# Altium schematic sheet DIGITAL IO_RELAY_SHEET.SchDoc
size 420 x 297 mm; SheetNumber: 20; SheetTotal: 27
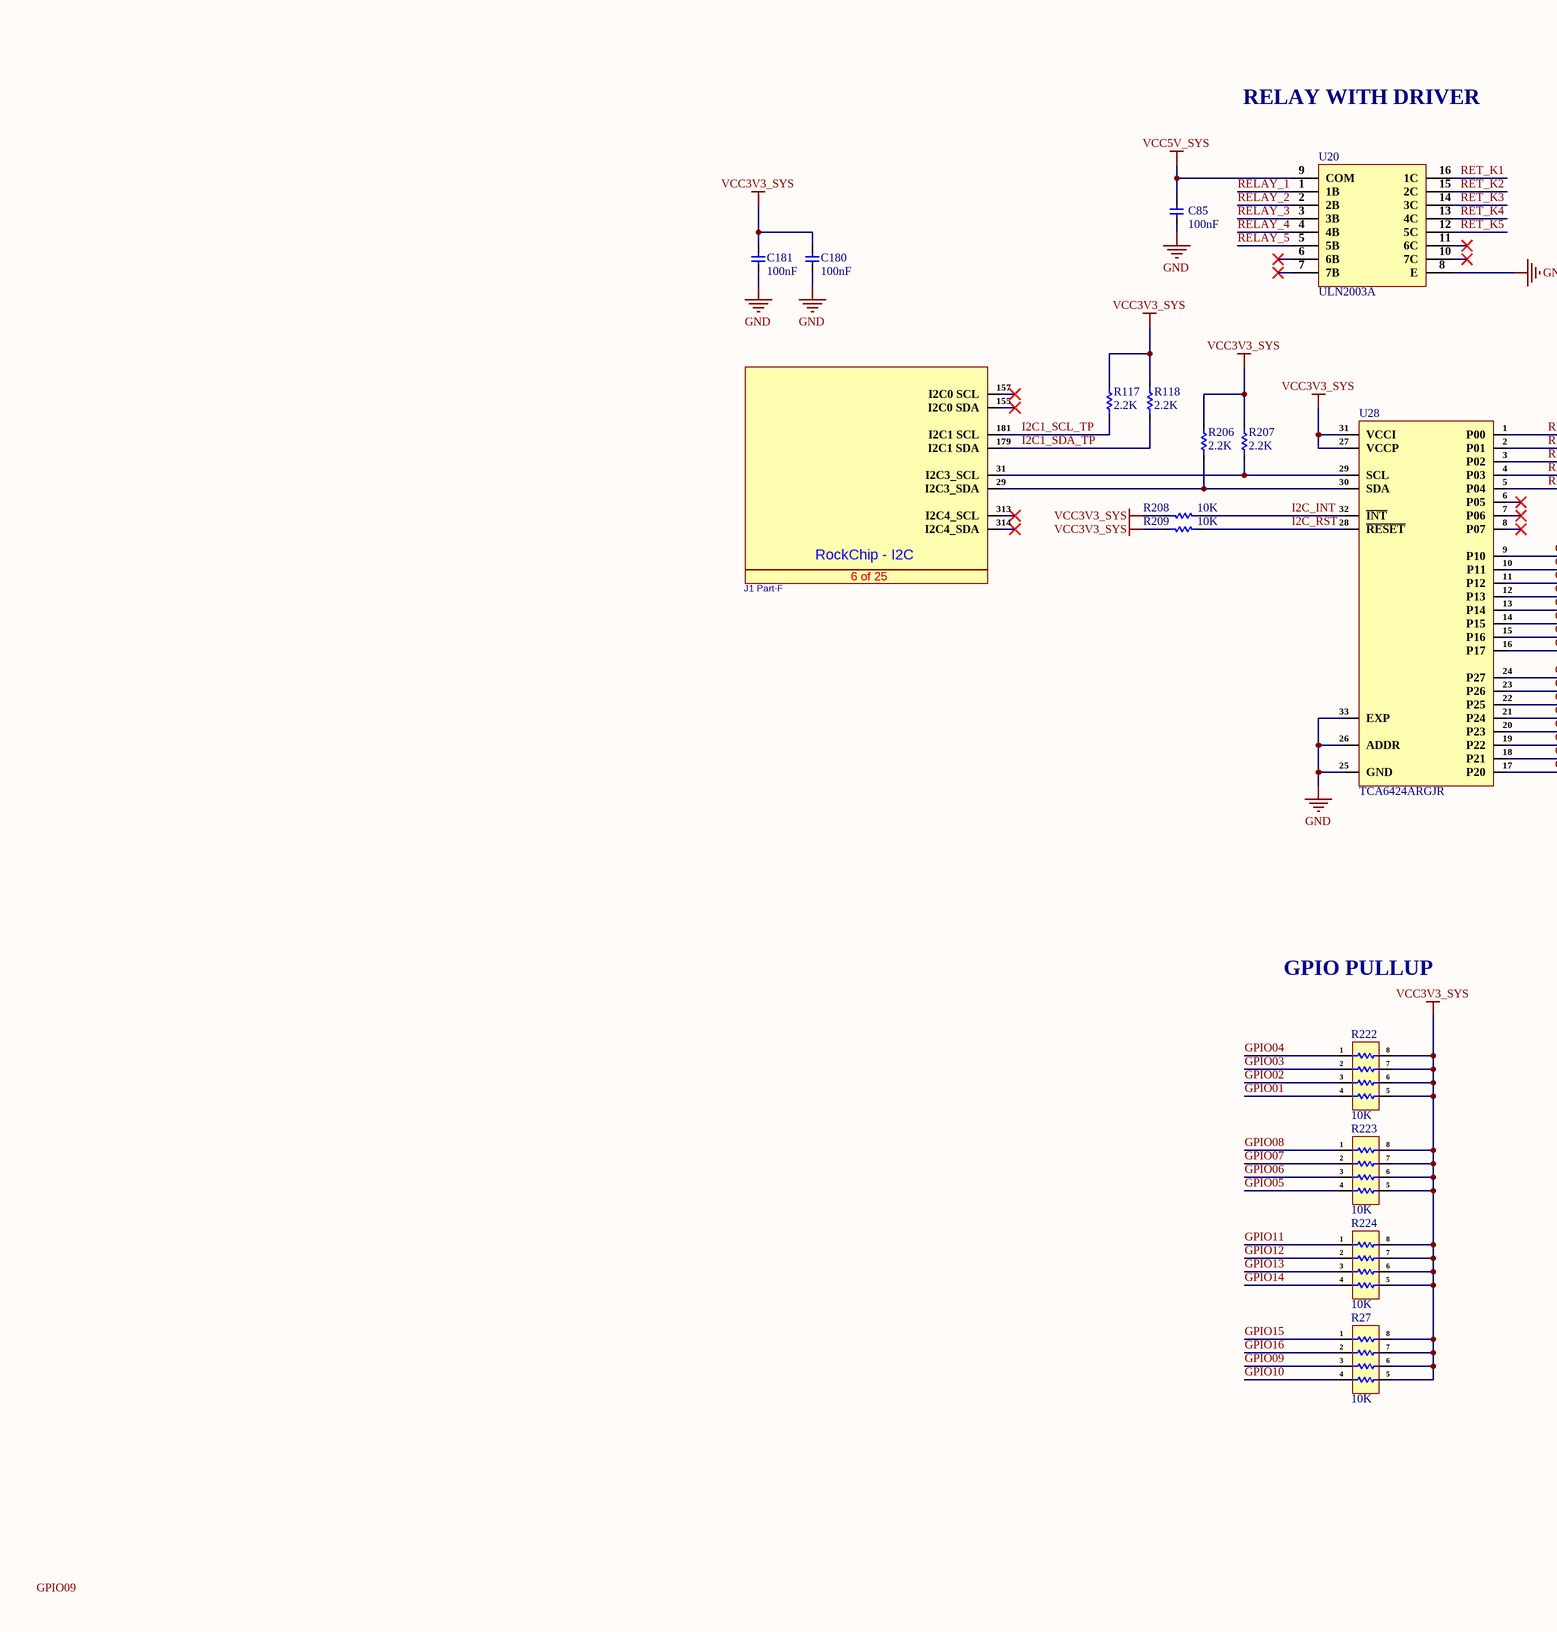
[diagram p0: DIGITAL IO_RELAY_SHEET.SchDoc, left]
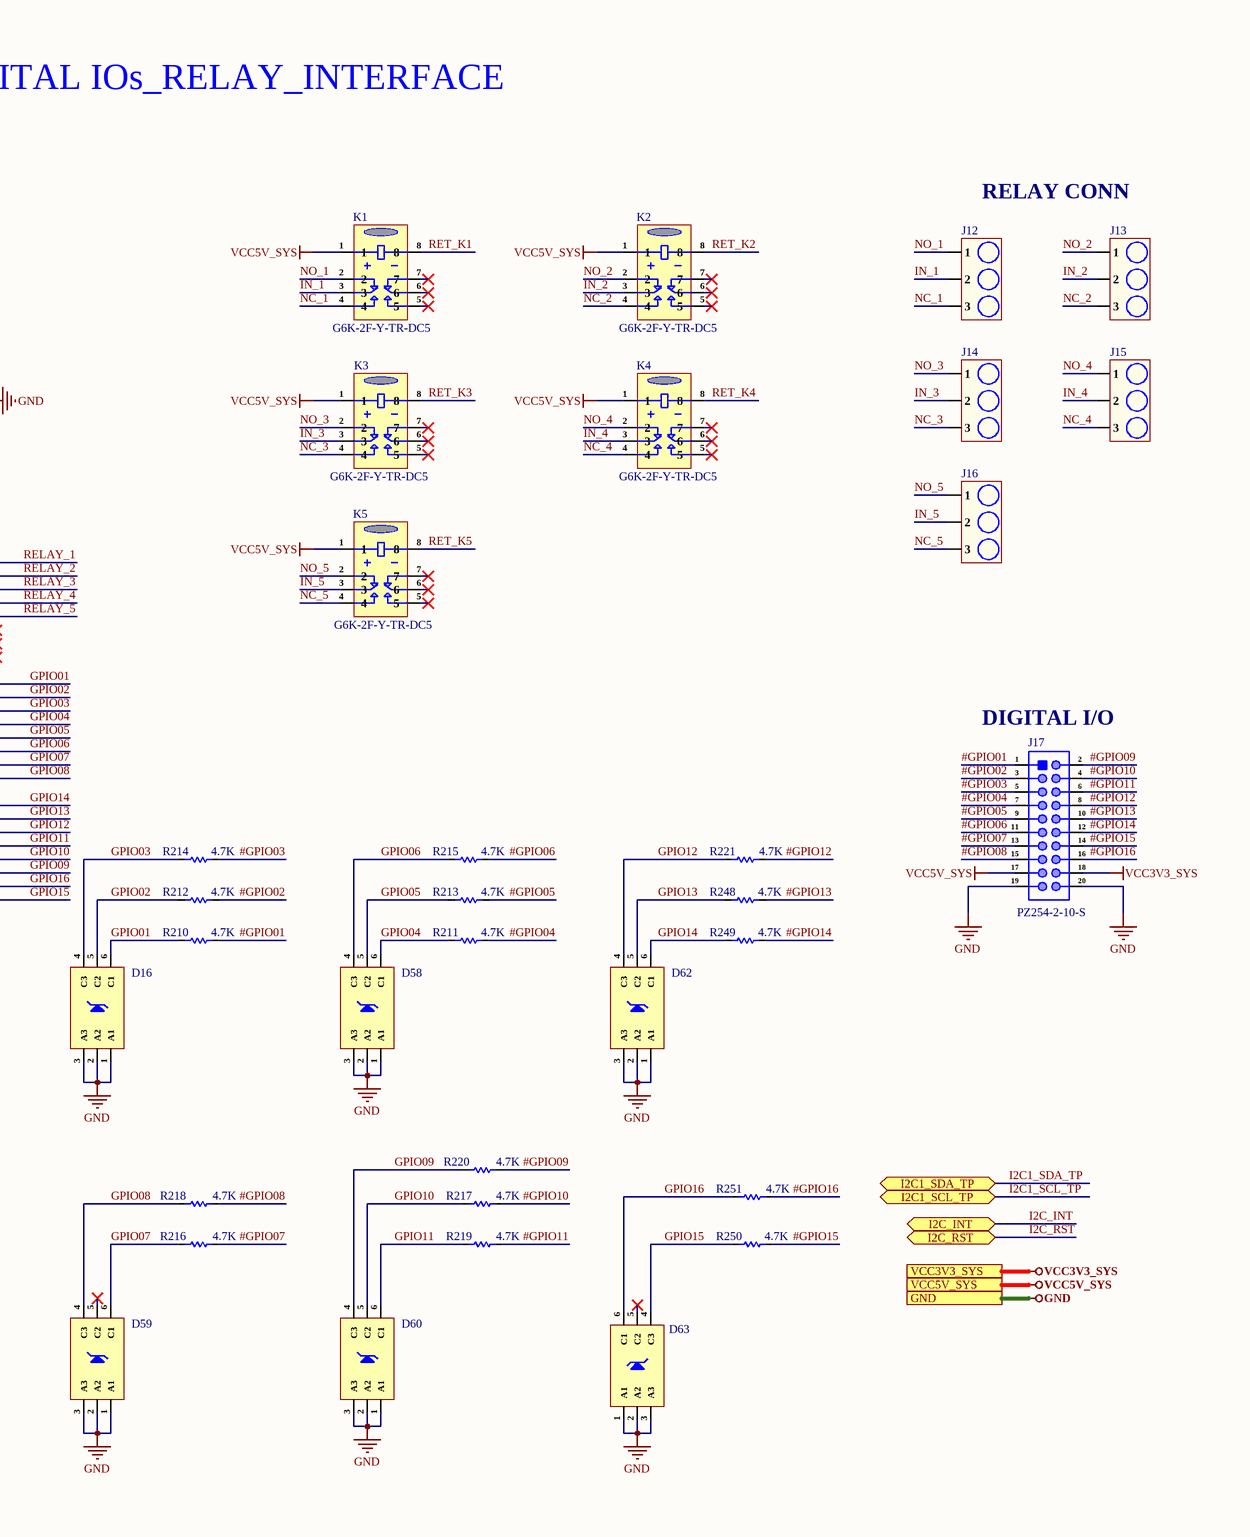
[diagram p1: DIGITAL IO_RELAY_SHEET.SchDoc, right]

## Parts
C85  100nF  [Cap-0402]
C180  100nF  [Cap-0402]
C181  100nF  [Cap-0402]
D16  BZX84C3V3TS-7-F  [SOT-363]  (value not drawn)
D58  BZX84C3V3TS-7-F  [SOT-363]  (value not drawn)
D59  BZX84C3V3TS-7-F  [SOT-363]  (value not drawn)
D60  BZX84C3V3TS-7-F  [SOT-363]  (value not drawn)
D62  BZX84C3V3TS-7-F  [SOT-363]  (value not drawn)
D63  BZX84C3V3TS-7-F  [SOT-363]  (value not drawn)
J1_Part-  AS0B826-S78B-7H  [AS0B826-S78B-7H]  (value not drawn)  (part F of 25)
J12  DB2ERC-3.5-3P-GN  [DB2ERC-3.5-3P-GN]  (value not drawn)
J13  DB2ERC-3.5-3P-GN  [DB2ERC-3.5-3P-GN]  (value not drawn)
J14  DB2ERC-3.5-3P-GN  [DB2ERC-3.5-3P-GN]  (value not drawn)
J15  DB2ERC-3.5-3P-GN  [DB2ERC-3.5-3P-GN]  (value not drawn)
J16  DB2ERC-3.5-3P-GN  [DB2ERC-3.5-3P-GN]  (value not drawn)
J17  PZ254-2-10-S  [PZ254-2-10-S]
K1  G6K-2F-Y-TR-DC5  [G6K-2F-Y-TR DC5]
K2  G6K-2F-Y-TR-DC5  [G6K-2F-Y-TR DC5]
K3  G6K-2F-Y-TR-DC5  [G6K-2F-Y-TR DC5]
K4  G6K-2F-Y-TR-DC5  [G6K-2F-Y-TR DC5]
K5  G6K-2F-Y-TR-DC5  [G6K-2F-Y-TR DC5]
R27  10K  [YC164-FR-0710KL]
R117  2.2K  [Res-0402]
R118  2.2K  [Res-0402]
R206  2.2K  [Res-0402]
R207  2.2K  [Res-0402]
R208  10K  [Res-0402]
R209  10K  [Res-0402]
R210  4.7K  [Res-0402]
R211  4.7K  [Res-0402]
R212  4.7K  [Res-0402]
R213  4.7K  [Res-0402]
R214  4.7K  [Res-0402]
R215  4.7K  [Res-0402]
R216  4.7K  [Res-0402]
R217  4.7K  [Res-0402]
R218  4.7K  [Res-0402]
R219  4.7K  [Res-0402]
R220  4.7K  [Res-0402]
R221  4.7K  [Res-0402]
R222  10K  [YC164-FR-0710KL]
R223  10K  [YC164-FR-0710KL]
R224  10K  [YC164-FR-0710KL]
R248  4.7K  [Res-0402]
R249  4.7K  [Res-0402]
R250  4.7K  [Res-0402]
R251  4.7K  [Res-0402]
U20  ULN2003A  [SOP-16_150mil]
U28  TCA6424ARGJR  [32-UQFN (5x5)]

## Ports
GND (see TOP SHEET[4B], AUDIO_INTERFACE[1D], BUCK REGULATOR[3D], DEBUG_UART_INTERFACE[3D], DUAL_SIM_INTERFACE[3D], ETHERNET_PHY0[4D], ETHERNET_PHY1[4D], GSM_INTERFACE[2D], HDMI_INTERFACE[3D], INPUT_PROTECTION[3D], LINEAR_VOLTAGE_REG[3D], MICRO_SD_INTERFACE[3D], MIPI-DSI DISPLAY[3D], POWER SECTION[3D], PUSH BUTTONs_INTERFACE[3C], RGB_LEDs_INTERFACE[3D], ROCKCHIP_PWR_SUPPLY[1D], ROCKCHIP_SYSTEM_CONTROL[3C], RS232_RS485_INTERFACE[3C], SENSOR_SHEET[3D], USB2.0_INTERFACE[3D], USB3.0_INTERFACE[3D], USB-C_INTERFACE[2D], WIEGAND_INTERFACE[3D], WIFI_BLUETOOTH_SHEET[4C]), I2C1_SCL_TP (bidir, see TOP SHEET[5B], MIPI-DSI DISPLAY[3D]), I2C1_SDA_TP (bidir, see TOP SHEET[5B], MIPI-DSI DISPLAY[3D]), I2C_INT (bidir, see TOP SHEET[5B], ROCKCHIP_GPIO_NC PINS[1D]), I2C_RST (bidir, see TOP SHEET[5B], ROCKCHIP_GPIO_NC PINS[1D]), VCC3V3_SYS (see TOP SHEET[4B], AUDIO_INTERFACE[1D], BUCK REGULATOR[3D], DEBUG_UART_INTERFACE[3D], ETHERNET_PHY0[4D], ETHERNET_PHY1[4D], GSM_INTERFACE[2D], HDMI_INTERFACE[3D], LINEAR_VOLTAGE_REG[3D], MIPI-DSI DISPLAY[3D], POWER SECTION[3D], PUSH BUTTONs_INTERFACE[3C], ROCKCHIP_PWR_SUPPLY[1D], ROCKCHIP_SYSTEM_CONTROL[3C], RS232_RS485_INTERFACE[3C], SENSOR_SHEET[3D], USB-C_INTERFACE[2D], WIEGAND_INTERFACE[3D], WIFI_BLUETOOTH_SHEET[4C]), VCC5V_SYS (see TOP SHEET[4B], BUCK REGULATOR[3D], HDMI_INTERFACE[3D], LINEAR_VOLTAGE_REG[3D], MIPI-DSI DISPLAY[3D], POWER SECTION[3D], RGB_LEDs_INTERFACE[3D], ROCKCHIP_PWR_SUPPLY[1D], USB2.0_INTERFACE[3D], USB3.0_INTERFACE[3D], USB-C_INTERFACE[2D], WIEGAND_INTERFACE[3D])

## Nets
GND: C85.2 C180.2 C181.2 D16.1(A1) D16.2(A2) D16.3(A3) D58.1(A1) D58.2(A2) D58.3(A3) D59.1(A1) D59.2(A2) D59.3(A3) D60.1(A1) D60.2(A2) D60.3(A3) D62.1(A1) D62.2(A2) D62.3(A3) D63.1(A1) D63.2(A2) D63.3(A3) J17.19 J17.20 U20.8(E) U28.25(GND) U28.26(ADDR) U28.33(EXP) ; port GND
VCC3V3_SYS: C180.1 C181.1 J17.18 R27.5 R27.6 R27.7 R27.8 R117.2 R118.2 R206.2 R207.2 R208.2 R209.2 R222.5 R222.6 R222.7 R222.8 R223.5 R223.6 R223.7 R223.8 R224.5 R224.6 R224.7 R224.8 U28.27(VCCP) U28.31(VCCI) ; port VCC3V3_SYS
VCC5V_SYS: C85.1 J17.17 K1.1 K2.1 K3.1 K4.1 K5.1 U20.9(COM) ; port VCC5V_SYS
#GPIO01: J17.1 R210.2
#GPIO02: J17.3 R212.2
#GPIO03: J17.5 R214.2
#GPIO04: J17.7 R211.2
#GPIO05: J17.9 R213.2
#GPIO06: J17.11 R215.2
#GPIO07: J17.13 R216.2
#GPIO08: J17.15 R218.2
#GPIO09: J17.2 R220.2
#GPIO10: J17.4 R217.2
#GPIO11: J17.6 R219.2
#GPIO12: J17.8 R221.2
#GPIO13: J17.10 R248.2
#GPIO14: J17.12 R249.2
#GPIO15: J17.14 R250.2
#GPIO16: J17.16 R251.2
GPIO01: D16.6(C1) R210.1 R222.4 U28.9(P10)
GPIO02: D16.5(C2) R212.1 R222.3 U28.10(P11)
GPIO03: D16.4(C3) R214.1 R222.2 U28.11(P12)
GPIO04: D58.6(C1) R211.1 R222.1 U28.12(P13)
GPIO05: D58.5(C2) R213.1 R223.4 U28.13(P14)
GPIO06: D58.4(C3) R215.1 R223.3 U28.14(P15)
GPIO07: D59.6(C1) R216.1 R223.2 U28.15(P16)
GPIO08: D59.4(C3) R218.1 R223.1 U28.16(P17)
GPIO09: D60.4(C3) R27.3 R220.1 U28.19(P22)
GPIO10: D60.5(C2) R27.4 R217.1 U28.20(P23)
GPIO11: D60.6(C1) R219.1 R224.1 U28.21(P24)
GPIO12: D62.4(C3) R221.1 R224.2 U28.22(P25)
GPIO13: D62.5(C2) R224.3 R248.1 U28.23(P26)
GPIO14: D62.6(C1) R224.4 R249.1 U28.24(P27)
GPIO15: D63.4(C3) R27.1 R250.1 U28.17(P20)
GPIO16: D63.6(C1) R27.2 R251.1 U28.18(P21)
I2C1_SCL_TP: J1_Part-.181(I2C1_SCL) R117.1 ; port I2C1_SCL_TP
I2C1_SDA_TP: J1_Part-.179(I2C1_SDA) R118.1 ; port I2C1_SDA_TP
I2C_INT: R208.1 U28.32(~{INT}) ; port I2C_INT
I2C_RST: R209.1 U28.28(~{RESET}) ; port I2C_RST
IN_1: J12.2 K1.3
IN_2: J13.2 K2.3
IN_3: J14.2 K3.3
IN_4: J15.2 K4.3
IN_5: J16.2 K5.3
NC_1: J12.3 K1.4
NC_2: J13.3 K2.4
NC_3: J14.3 K3.4
NC_4: J15.3 K4.4
NC_5: J16.3 K5.4
NO_1: J12.1 K1.2
NO_2: J13.1 K2.2
NO_3: J14.1 K3.2
NO_4: J15.1 K4.2
NO_5: J16.1 K5.2
RELAY_1: U20.1(1B) U28.1(P00)
RELAY_2: U20.2(2B) U28.2(P01)
RELAY_3: U20.3(3B) U28.3(P02)
RELAY_4: U20.4(4B) U28.4(P03)
RELAY_5: U20.5(5B) U28.5(P04)
RET_K1: K1.8 U20.16(1C)
RET_K2: K2.8 U20.15(2C)
RET_K3: K3.8 U20.14(3C)
RET_K4: K4.8 U20.13(4C)
RET_K5: K5.8 U20.12(5C)
NetJ1_Part-_29: J1_Part-.29(I2C3_SDA) R206.1 U28.30(SDA)
NetJ1_Part-_31: J1_Part-.31(I2C3_SCL) R207.1 U28.29(SCL)

Not connected (* = marked no-connect by the designer): D59 5(C2)*; D63 5(C2)*; J1_Part- 155(I2C0_SDA)* 157(I2C0_SCL)* 313(I2C4_SCL)* 314(I2C4_SDA)*; K1 5* 6* 7*; K2 5* 6* 7*; K3 5* 6* 7*; K4 5* 6* 7*; K5 5* 6* 7*; U20 6(6B)* 7(7B)* 10(7C)* 11(6C)*; U28 6(P05)* 7(P06)* 8(P07)*

## Notes on the sheet
- DIGITAL IOs_RELAY_INTERFACE
- RELAY WITH DRIVER
- RELAY CONN
- (near J17) DIGITAL I/O
- GPIO PULLUP
- Labels drawn without touching a wire or pin: GPIO09
- File:
- Title:
- Date:
- Page
- Num:
- Total:
- Drawn By: Huzaifa Ali
- (in symbol AS0B826-S78B-7H, part F) RockChip - I2C; 6 of 25

## Library data of the parts
C85 C180 C181 = CC0402KRX5R7BB104: CAP CER 0.1UF 16V X5R 0402; Manufacturer: Yageo; Tolerance: 10%; Manufacturer Part Number: CC0402KRX5R7BB104; RoHS: Yes; Category: Ceramic Capacitors; Supplier 1: Mouser; Stock 1: 936792; Pricing 1: 1=0.10000, 10=0.02300, 50=0.02300, 100=0.01100, 1000=0.00600, 10000=0.00400 (USD); Mount: Surface Mount; Case/Package: 0402; Number of Pins: 2; Case Code (Metric): 1005; Case Code (Imperial): 0402; Min Operating Temperature: -55°C; Max Operating Temperature: 85°C; Capacitance: 100nF; Dielectric: X5R; Packaging: Tape and Reel; Voltage Rating: 16V; Package Quantity: 1; Voltage Rating (DC): 16V; Termination: SMD/SMT; Resistor Type: Ceramic; Series: CC; Construction: Flat; Length: 1mm; Width: 0.02inch; Height: 0.5mm; Thickness: 0.022inch; Depth: 0.5mm; Radiation Hardening: No; REACH SVHC: Unknown; Lead Free: Lead Free; Halogen Free: Halogen Free; RoHS Compliant: Yes; ComponentLink1URL: https://datasheet.ciiva.com/155/mlccorderingcode-155879.pdf?src-supplier=Digi-Key; ComponentLink1Description: https://datasheet.ciiva.com/155/mlccorderingcode-155879.pdf?src-supplier=Digi-Key; ComponentLink2URL: https://datasheet.ciiva.com/155/mlccorderingcode-155878.pdf?src-supplier=Digi-Key; ComponentLink2Description: https://datasheet.ciiva.com/155/mlccorderingcode-155878.pdf?src-supplier=Digi-Key; ComponentLink3URL: https://datasheet.ciiva.com/155/mlccorderingcode-155880.pdf?src-supplier=Digi-Key; ComponentLink3Description: https://datasheet.ciiva.com/155/mlccorderingcode-155880.pdf?src-supplier=Digi-Key; ComponentLink4URL: https://datasheet.ciiva.com/11464/upy-gphc-x5r-4v-to-50v-12-11464869.pdf?src-supplier=Avnet; ComponentLink4Description: https://datasheet.ciiva.com/11464/upy-gphc-x5r-4v-to-50v-12-11464869.pdf?src-supplier=Avnet; Supplier Part Number 1: 603-CC402KRX5R7BB104; LCSC Part Number: C106204
D16 D58-D60 D62 D63 = BZX84C3V3TS-7-F: DIODE ZENER ARRAY 3.3V SOT363; Manufacturer: Diodes Incorporated; Manufacturer Part Number: BZX84C3V3TS-7-F; Package: SOT-363-6; LCSC Part Number: C5124989; Item Type: Diode; ComponentLink1Description: LCSC; ComponentLink1URL: https://www.lcsc.com/product-detail/Zener-Diodes_Diodes-Incorporated-BZX84C3V3TS-7-F_C5124989.html
J1_Part- = AS0B826-S78B-7H: SMD,P=0.5mm,Surface Mount，Right Angle; Manufacturer: FOXCONN; Item Type: Card Edge Connectors; Supplier: LCSC; Manufacturer Part Number: AS0B826-S78B-7H; RoHS: No; Stock: 4979; Pricing: 1=9.21, 10=8.287, 25=7.8064, 50=7.6064, 100=7.4062 (USD); LCSC Part Number: C426232
J12-J16 = DB2ERC-3.5-3P-GN: 250V 10A 3 Bend -40℃~+105℃ 1 3.5mm 1x3P Green Board Edge/Receptacle-Close Push-Pull,P=3.5mm Pluggable System Terminal Block ROHS; Manufacturer: DORABO; Manufacturer Part Number: DB2ERC-3.5-3P-GN; Package: Push-Pull,P=5.08mm; LCSC Part Number: C430551; Item Type: Terminal Block; ComponentLink1Description: LCSC; ComponentLink1URL: https://www.lcsc.com/product-detail/Pluggable-System-span-style-background-color-ff0-Terminal-span-span-style-background-color-ff0-Block-span_DORABO-DB2ERC-3-5-3P-GN_C430551.html
J17 = PZ254-2-10-S: 250V 3A Brick nogging Square Pins 2.5mm 260℃@5S 6mm 20P -40℃~+105℃ 2.54mm 双排 Black 2.54mm 2x10P SMD,P=2.54mm Pin Headers ROHS; Manufacturer: HCTL; Item Type: Male Header; Manufacturer Part Number: PZ254-2-10-S; LCSC Part Number: C3294468
K1-K5 = G6K-2F-Y-TR-DC5: RELAY TELECOM DPDT 1A 5V; Manufacturer: Omron; Supplier: Digikey; Supplier Part Number: Z128CT-ND; Manufacturer Part Number: G6K-2F-Y-TR-DC5; RoHS: Yes; Category: Signal Relays; Stock: 17486; Pricing: 1=4.49, 10=4.211, 25=3.7428, 50=3.5558, 100=3.3686, 250=2.99428 (USD); ComponentLink1URL: https://datasheet.ciiva.com/2416/en-g6k-2416490.pdf?src-supplier=Digikey; ComponentLink1Description: https://datasheet.ciiva.com/2416/en-g6k-2416490.pdf?src-supplier=Digikey; ComponentLink2URL: https://datasheet.ciiva.com/30094/81en-g6k-30094551.pdf?src-supplier=Onlinecomponents.com; ComponentLink2Description: https://datasheet.ciiva.com/30094/81en-g6k-30094551.pdf?src-supplier=Onlinecomponents.com; LCSC Part Number: C47190; Item Type: Relay
R27 R222-R224 = YC164-FR-0710KL: RES ARRAY 4 RES 10K OHM 1206; Manufacturer: Yageo; Item Type: Resistor Array; Tolerance: 1%; Voltage Rating: 50V; Number of Elements: 4; Value: 10kR; Circuit Type: Isolated; Power Per Element: 62.5mW; Temperature Coefficient: 200ppm/°C; Manufacturer Part Number: YC164-FR-0710KL; RoHS: Yes; Category: Resistor Arrays; ComponentLink1URL: http://www.farnell.com/datasheets/2167431.pdf?src-supplier=Farnell; ComponentLink1Description: http://www.farnell.com/datasheets/2167431.pdf?src-supplier=Farnell; ComponentLink2URL: https://media.digikey.com/pdf/Data%20Sheets/Yageo%20PDFs/YC102-358,TC122-164_Series_DS.pdf?src-supplier=Digi-Key; ComponentLink2Description: https://media.digikey.com/pdf/Data%20Sheets/Yageo%20PDFs/YC102-358,TC122-164_Series_DS.pdf?src-supplier=Digi-Key; ComponentLink3URL: http://www.farnell.com/datasheets/2167431.pdf?src-supplier=Element14; ComponentLink3Description: http://www.farnell.com/datasheets/2167431.pdf?src-supplier=Element14; ComponentLink4URL: http://www.farnell.com/datasheets/443424.pdf?src-supplier=Element14; ComponentLink4Description: http://www.farnell.com/datasheets/443424.pdf?src-supplier=Element14; ComponentLink5URL: http://www.farnell.com/datasheets/2167431.pdf?src-supplier=Newark; ComponentLink5Description: http://www.farnell.com/datasheets/2167431.pdf?src-supplier=Newark; LCSC Part Number: C110924; Supplier 1: Future Electronics; Stock 1: 25000; Pricing 1: 5000=0.0101, 20000=0.0095, 50000=0.0092, 125000=0.0089, 200000=0.0085 (USD); Mounting Technology: Surface Mount; Pins: 8; Case Code (Metric): 3216; Case Code (Imperial): 1206; Min Operating Temperature: -55°C; Max Operating Temperature: 155°C; Packaging: Tape and Reel; Number of Resistors: 4; Number of Circuits: 4; Series: YC164; Resistance Tolerance: 1%; Length: 0.126inch; Width: 0.063inch; Height: 0.028inch; Lead Free: Lead Free; RoHS Compliant: Yes; Reach SVHC Compliant: Unknown; Supplier Part Number 1: 5054288
R117 R118 R206 R207 = RC0402FR-072K2L: RES SMD 2.2K OHM 1% 1/16W 0402; Manufacturer: Yageo; Power Rating: 63mW; Resistance: 2.2kR; Voltage Rating: 50V; Temperature Coefficient: 100ppm/°C; Supplier 1: Digi-Key; Manufacturer Part Number: RC0402FR-072K2L; Stock 1: 966157; Pricing 1: 1=0.1, 10=0.016, 100=0.0066, 1000=0.00299, 2500=0.00259, 5000=0.00214 (USD); Case/Package: 0402; Case Code (Imperial): 0402; Case Code (Metric): 1005; Size Code: 0402; Min Operating Temperature: -55°C; Max Operating Temperature: 155°C; Tolerance: 1%; Packaging: Tape and Reel; Resistor Type: Thick Film; Termination: SMD/SMT; Features: Moisture Resistant; Series: RC; Max Power Dissipation: 63mW; Number of Terminations: 2; Resistance Tolerance: 1%; Construction: Rectangular; Length: 1mm; Width: 0.5mm; Height: 0.35mm; Depth: 0.5mm; RoHS Compliant: Yes; Military Standard: Not; Lead Free: Lead Free; ComponentLink1URL: http://www.farnell.com/datasheets/2167052.pdf?src-supplier=Element14; ComponentLink1Description: http://www.farnell.com/datasheets/2167052.pdf?src-supplier=Element14; ComponentLink2URL: http://www.yageo.com/documents/recent/PYu-RC_Group_51_RoHS_L_9.pdf?src-supplier=Mouser; ComponentLink2Description: http://www.yageo.com/documents/recent/PYu-RC_Group_51_RoHS_L_9.pdf?src-supplier=Mouser; ComponentLink3URL: http://documents.rs-components.com/techlib://itc_doclist_GB.htm?stockno=6186532&src-supplier=RSComponents; ComponentLink3Description: http://documents.rs-components.com/techlib://itc_doclist_GB.htm?stockno=6186532&src-supplier=RSComponents; ComponentLink4URL: http://www.yageo.com/documents/recent/PYu-RC0402_51_RoHS_L_6_r.pdf?src-supplier=Future+Electronics; ComponentLink4Description: http://www.yageo.com/documents/recent/PYu-RC0402_51_RoHS_L_6_r.pdf?src-supplier=Future+Electronics; Supplier Part Number 1: 311-2.20KLRCT-ND; LCSC Part Number: C114762; Weight: 2.3E-05oz; Technology: THICK FILM; REACH SVHC: Unknown
R208 R209 = RC0402FR-0710KL: RES 10K OHM 1% 1/16W 0402; Manufacturer: Yageo; Resistance: 10kR; Voltage Rating (DC): 50V; Temperature Coefficient: 100ppm/°C; Power Rating: 62.5mW; Max Power Dissipation: 63mW; Item Type: Resistor; Supplier 1: Mouser; Manufacturer Part Number: RC0402FR-0710KL; RoHS: Yes; Category: Chip SMD Resistors; Stock 1: 18648329; Pricing 1: 1=0.10000, 10=0.01400, 50=0.01400, 100=0.00500, 1000=0.00300, 10000=0.00200 (USD); Case/Package: 0402; Number of Pins: 2; Case Code (Imperial): 0402; Case Code (Metric): 1005; Min Operating Temperature: -55°C; Max Operating Temperature: 155°C; Resistor Type: Thick Film; Tolerance: 1%; Packaging: Tape and Reel; Voltage Rating: 50V; Termination: SMD/SMT; Working Voltage: 50V; Number of Terminations: 2; Features: Moisture Resistant; Series: RC; Resistance Tolerance: 1%; Construction: Rectangular; Length: 1mm; Width: 0.5mm; Height: 0.32mm; Depth: 0.5mm; Lead Pitch: 0.2mm; REACH SVHC: No SVHC; Lead Free: Lead Free; RoHS Compliant: Yes; Military Standard: Not; ComponentLink1URL: https://datasheet.ciiva.com/7660/38568-7660787.pdf?src-supplier=Element14; ComponentLink1Description: https://datasheet.ciiva.com/7660/38568-7660787.pdf?src-supplier=Element14; ComponentLink2URL: https://datasheet.ciiva.com/7849/1686128-7849814.pdf?src-supplier=Element14; ComponentLink2Description: https://datasheet.ciiva.com/7849/1686128-7849814.pdf?src-supplier=Element14; ComponentLink3URL: https://datasheet.ciiva.com/7983/1018594-7983486.pdf?src-supplier=Element14; ComponentLink3Description: https://datasheet.ciiva.com/7983/1018594-7983486.pdf?src-supplier=Element14; ComponentLink4URL: https://datasheet.ciiva.com/22747/1018594-22747512.pdf?src-supplier=Element14; ComponentLink4Description: https://datasheet.ciiva.com/22747/1018594-22747512.pdf?src-supplier=Element14; ComponentLink5URL: https://datasheet.ciiva.com/12667/pyu-rc0402-51-rohs-l-6-r-12667067.pdf?src-supplier=Mouser; ComponentLink5Description: https://datasheet.ciiva.com/12667/pyu-rc0402-51-rohs-l-6-r-12667067.pdf?src-supplier=Mouser; ComponentLink6URL: https://datasheet.ciiva.com/7849/1784430-7849813.pdf?src-supplier=Element14; ComponentLink6Description: https://datasheet.ciiva.com/7849/1784430-7849813.pdf?src-supplier=Element14; ComponentLink7URL: https://datasheet.ciiva.com/7849/1784430-7849815.pdf?src-supplier=Element14; ComponentLink7Description: https://datasheet.ciiva.com/7849/1784430-7849815.pdf?src-supplier=Element14; Supplier Part Number 1: 603-RC0402FR-0710KL; LCSC Part Number: C60490
R210-R221 R248-R251 = RC0402FR-074K7L: RES 4.7K OHM 1% 1/16W 0402; Manufacturer: Yageo; Voltage Rating (DC): 50V; Power Rating: 62.5mW; Resistance: 4.7kR; Temperature Coefficient: 100ppm/°C; Max Power Dissipation: 63mW; Item Type: Resistor; Supplier 1: Avnet; Manufacturer Part Number: RC0402FR-074K7L; RoHS: Yes; Category: Chip SMD Resistors; Stock 1: 2420000; Pricing 1: 10000=0.00085 (USD); Case/Package: 0402; Number of Pins: 2; Case Code (Imperial): 0402; Case Code (Metric): 1005; Size Code: 0402; Min Operating Temperature: -55°C; Max Operating Temperature: 155°C; Tolerance: 1%; Voltage Rating: 50V; Packaging: Tape and Reel; Resistor Type: Thick Film; Termination: SMD/SMT; Features: Moisture Resistant; Series: RC; Number of Terminations: 2; Resistance Tolerance: 1%; Construction: Rectangular; Length: 1mm; Width: 0.5mm; Height: 0.32mm; Depth: 0.5mm; Height - Seated (Max): 0.016inch; RoHS Compliant: Yes; Reach SVHC Compliant: Yes; Military Standard: Not; Lead Free: Lead Free; ComponentLink1URL: https://datasheet.ciiva.com/22661/1686128-22661342.pdf?src-supplier=Element14; ComponentLink1Description: https://datasheet.ciiva.com/22661/1686128-22661342.pdf?src-supplier=Element14; ComponentLink2URL: https://datasheet.ciiva.com/7850/1018594-7850022.pdf?src-supplier=Element14; ComponentLink2Description: https://datasheet.ciiva.com/7850/1018594-7850022.pdf?src-supplier=Element14; ComponentLink3URL: https://datasheet.ciiva.com/7850/1018594-7850023.pdf?src-supplier=Element14; ComponentLink3Description: https://datasheet.ciiva.com/7850/1018594-7850023.pdf?src-supplier=Element14; ComponentLink4URL: https://datasheet.ciiva.com/15215/getdatasheetpartid-328119-15215035.pdf?src-supplier=Verical; ComponentLink4Description: https://datasheet.ciiva.com/15215/getdatasheetpartid-328119-15215035.pdf?src-supplier=Verical; Supplier Part Number 1: RC0402FR-074K7L; LCSC Part Number: C105871
U20 = ULN2003A: 100uA@50V 3V@2V,300mA 1.6V@350mA 4mA@12V 100uA@50V 1.25V@350mA 500mA 25pF SOP-16_150mil Darlington Transistor Arrays ROHS; Manufacturer: Mixic; Item Type: IC; Manufacturer Part Number: ULN2003A; Package: SOP-16_150mil; LCSC Part Number: C181730; ComponentLink1Description: LCSC; ComponentLink1URL: https://www.lcsc.com/product-detail/Darlington-Transistor-Arrays_Mixic-ULN2003A_C181730.html
U28 = TCA6424ARGJR: IC XPNDR 400KHZ I2C SMBUS 32UQFN; Manufacturer: Texas Instruments; Min Supply Voltage: 1.65V; Max Supply Voltage: 5.5V; Output Current: 25mA; Number of Outputs: 24; Output Type: PUSH-PULL; Supplier: Mouser; Supplier Part Number: 595-TCA6424ARGJR; Manufacturer Part Number: TCA6424ARGJR; RoHS: Yes; Category: Interface ICs; Stock: 59506; Pricing: 1=2.13, 10=1.81, 50=1.81, 100=1.54, 1000=1.05, 10000=0.894 (USD); Case/Package: QFN; Pins: 32; Weight: 0.002116oz; Min Operating Temperature: -40°C; Max Operating Temperature: 85°C; Packaging: Tape and Reel; Number of I/Os: 24; Clock Frequency: 400kHz; Frequency: 400kHz; Series: -; Length: 5.15mm; Width: 5.15mm; Height: 0.6mm; Radiation Hardening: No; Reach SVHC Compliant: No; Lead Free: Lead Free; RoHS Compliant: Yes; ComponentLink1URL: https://datasheet.ciiva.com/1600/tca6424a-1600866.pdf?src-supplier=Newark; ComponentLink1Description: https://datasheet.ciiva.com/1600/tca6424a-1600866.pdf?src-supplier=Newark; ComponentLink2URL: https://datasheet.ciiva.com/1496/1535173-1496151.pdf?src-supplier=Element14; ComponentLink2Description: https://datasheet.ciiva.com/1496/1535173-1496151.pdf?src-supplier=Element14; ComponentLink3URL: https://datasheet.ciiva.com/22652/1699435-22652096.pdf?src-supplier=Element14; ComponentLink3Description: https://datasheet.ciiva.com/22652/1699435-22652096.pdf?src-supplier=Element14; ComponentLink4URL: https://datasheet.ciiva.com/1780/tca6424a-1780437.pdf?src-supplier=Digikey; ComponentLink4Description: https://datasheet.ciiva.com/1780/tca6424a-1780437.pdf?src-supplier=Digikey; ComponentLink5URL: https://datasheet.ciiva.com/4826/scps193b-101393-4826180.pdf?src-supplier=Mouser; ComponentLink5Description: https://datasheet.ciiva.com/4826/scps193b-101393-4826180.pdf?src-supplier=Mouser; ComponentLink6URL: https://datasheet.ciiva.com/15134/getdatasheetpartid-254651-15134577.pdf?src-supplier=Verical; ComponentLink6Description: https://datasheet.ciiva.com/15134/getdatasheetpartid-254651-15134577.pdf?src-supplier=Verical; ComponentLink7URL: https://datasheet.ciiva.com/1505/1535173-1505147.pdf?src-supplier=Farnell; ComponentLink7Description: https://datasheet.ciiva.com/1505/1535173-1505147.pdf?src-supplier=Farnell; ComponentLink8URL: https://datasheet.ciiva.com/1780/tca6424a-1780438.pdf?src-supplier=Digikey; ComponentLink8Description: https://datasheet.ciiva.com/1780/tca6424a-1780438.pdf?src-supplier=Digikey; ComponentLink9URL: https://datasheet.ciiva.com/1780/tca6424a-1780439.pdf?src-supplier=Digikey; ComponentLink9Description: https://datasheet.ciiva.com/1780/tca6424a-1780439.pdf?src-supplier=Digikey; ComponentLink10URL: https://datasheet.ciiva.com/14195/tca6424a-14195387.pdf?src-supplier=Avnet; ComponentLink10Description: https://datasheet.ciiva.com/14195/tca6424a-14195387.pdf?src-supplier=Avnet; ComponentLink11URL: https://datasheet.ciiva.com/41460/001187873-da-01-en-ic-i-o-expander-tca6424argjr-uqfn-32-tid-41460550.pdf?src-supplier=Conrad; ComponentLink11Description: https://datasheet.ciiva.com/41460/001187873-da-01-en-ic-i-o-expander-tca6424argjr-uqfn-32-tid-41460550.pdf?src-supplier=Conrad; LCSC Part Number: C80692; Item Type: IC